# EAGLE design LED_Driver_SubCkt (EAGLE 7.6.0)
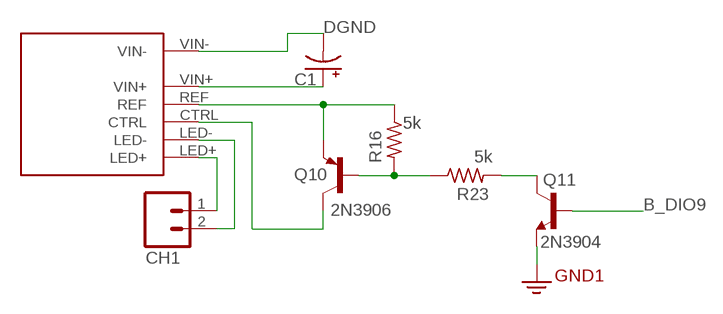
[diagram p0: schematic, sheet 1]

## Parts
BUCKPUCK1  BUCKPUCK-350-I  [BUCKPUCK_I]
C1  CPOL-USE5-10.5  [E5-10,5]
CH1  M023.5MM_LOCK  [SCREWTERMINAL-3.5MM-2_LOCK]
Q10  2N3906  MMBT3906LT1-PNP-SOT23-BEC  [SOT23-BEC]
Q11  2N3904  MMBT3904LT1-NPN-SOT23-BEC  [SOT23-BEC]
R16  5k  RESISTOR_SM0805S  [0805S]
R23  5k  RESISTOR_SM0805S  [0805S]

## Nets
B_DIO9: Q11.B
CTRL1: BUCKPUCK1.CTRL Q10.C
DGND: BUCKPUCK1.LED- BUCKPUCK1.VIN- C1.- CH1.2 Q11.E ; supply symbol labelled GND2
N$13: BUCKPUCK1.LED+ CH1.1
N$16: BUCKPUCK1.VIN+ C1.+
N$22: BUCKPUCK1.REF Q10.E R16.1
N$29: Q10.B R16.2 R23.1
N$42: Q11.C R23.2

## Library data of the parts
BUCKPUCK1 = Pavel-PowerIC:BUCKPUCK-*-?
C1 = adafruit:CPOL-US: POLARIZED CAPACITOR, American symbol
CH1 = SparkFun:M02: Header 2 Standard 2-pin 0.1" header. Use with straight break away headers (SKU : PRT-00116), right angle break away headers (PRT-00553), swiss pins (PRT-00743), machine pins (PRT-00117), and female headers (PRT-00115). Molex polarized connector foot print use with SKU : PRT-08233 with associated crimp pins and housings.
Q10 = transistor:*-PNP-: PNP Transistror
Q11 = transistor-neu-to92:*-NPN-: NPN Transistror
R16 R23 = SteveS:RESISTOR_SM

## Board
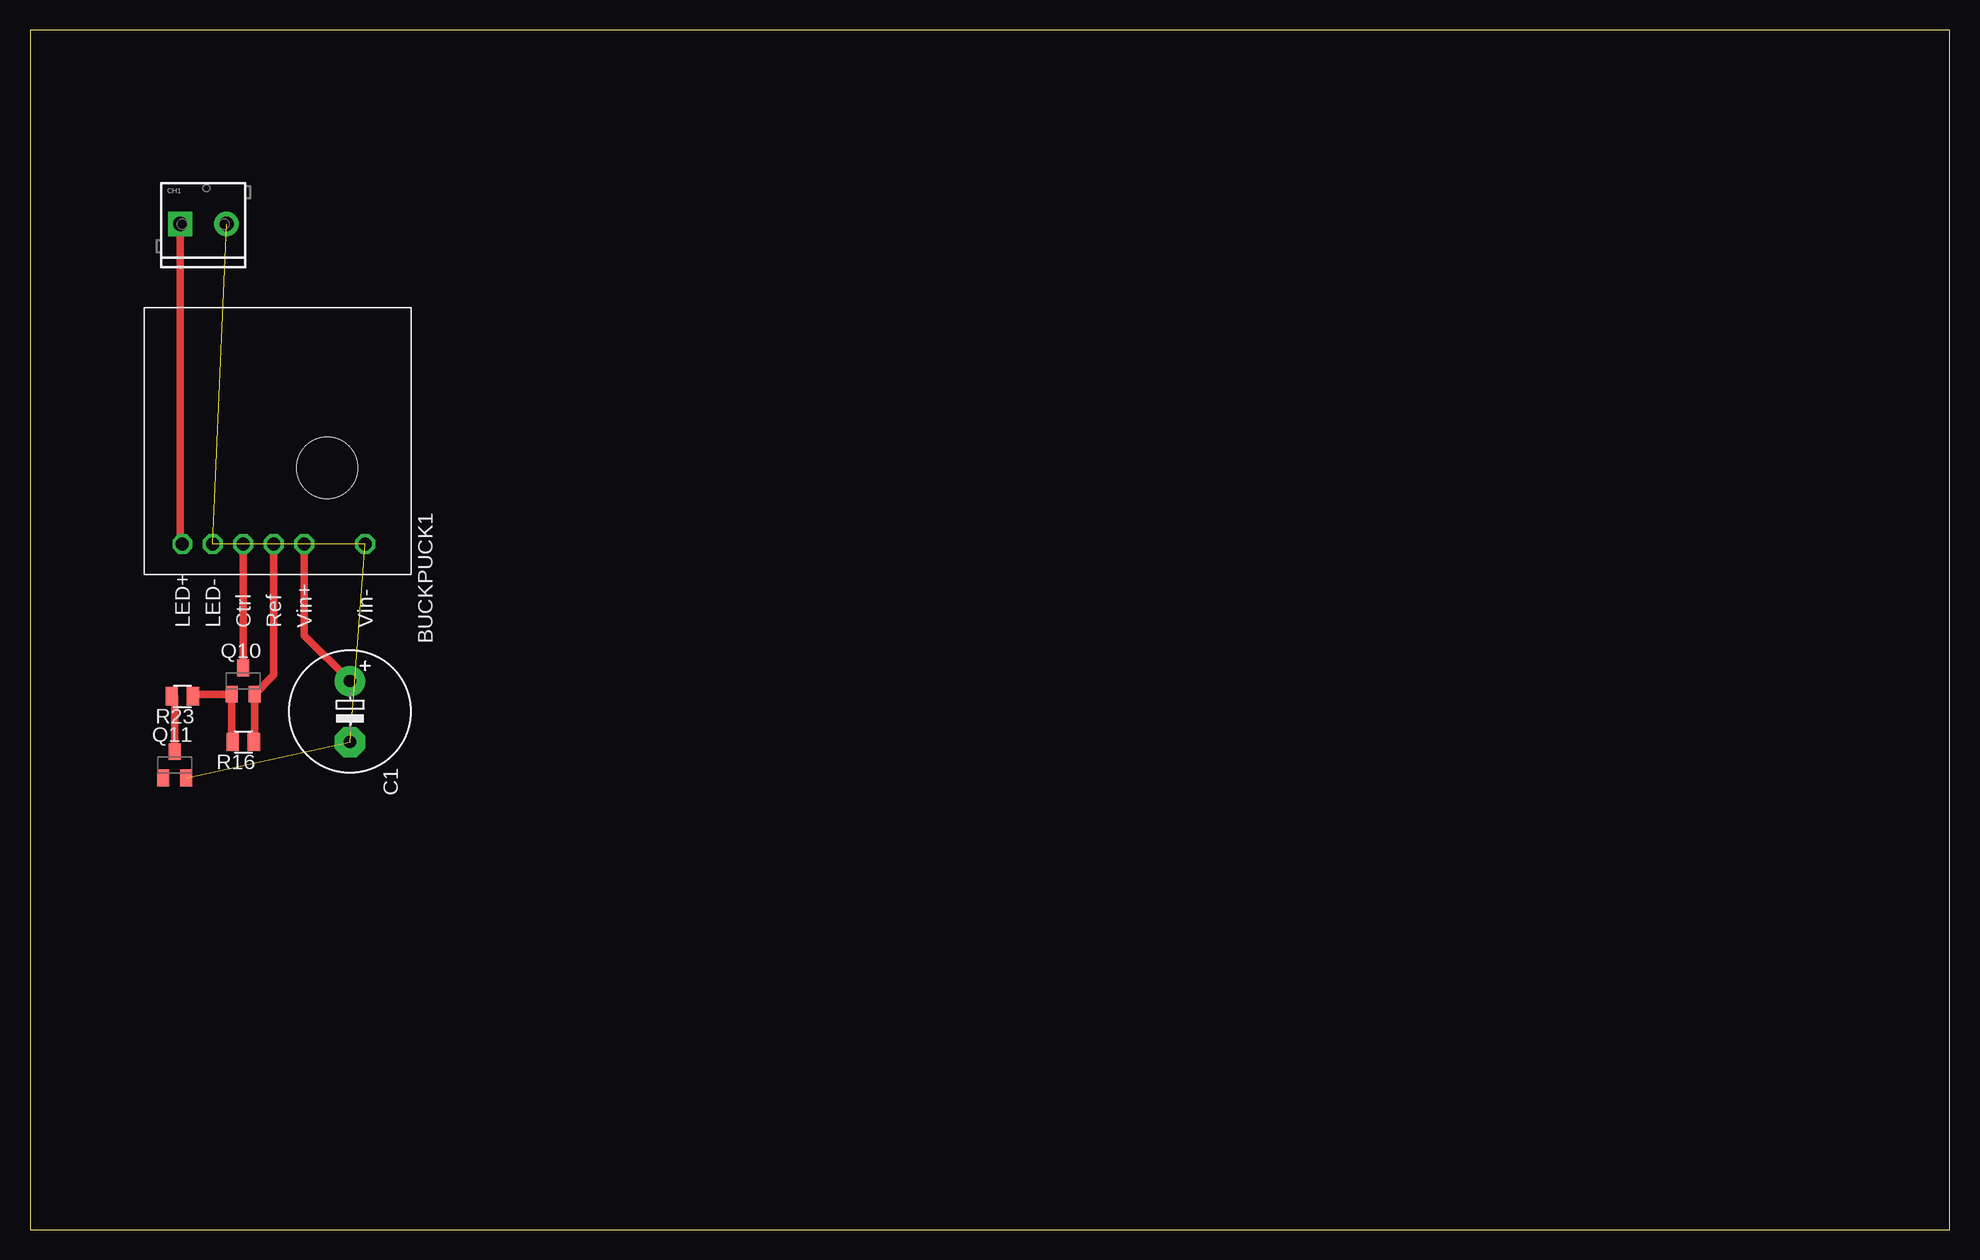
[diagram p1: board, top side]

Size 160 x 100 mm. Coordinates in mm from the lower left corner, seen from the top.
Outline: 0,0 160,0 160,100 0,100 0,0
Copper layers (1*16): Top 0.035mm / dielectric 1.5mm / Bottom 0.035mm
Design rules "default": minimum track width 10mil, minimum drill 24mil, track to track 8mil, track to pad 8mil, pad to pad 8mil, via to via 8mil, smd to smd 8mil, copper to edge 40mil, drill to drill 8mil, minimum pad ring 10mil, minimum via ring 8mil, stop-mask expansion 4mil, vias tented up to drill 0mil, thermal gap 10mil

### Footprints (pad centres in the part's own frame; a part is rotated, then mirrored left to right if it is on the bottom)
BUCKPUCK_I = drill 1.1 octagon: CTRL -8.89,2.54; LED+ -8.89,7.62; LED- -8.89,5.08; REF -8.89,0; VIN+ -8.89,-2.54; VIN- -8.89,-7.62 | hole 5.08: -2.54,-4.445
E5-10,5 = drill 1.016 pad 2.54: + -2.54,0 | drill 1.016 pad 2.54 octagon: - 2.54,0
SCREWTERMINAL-3.5MM-2_LOCK = drill 1.2 pad 2.032 square: 1 -0.178,0 | drill 1.2 pad 2.032: 2 3.678,0
SOT23-BEC = smd 1 x 1.4: B -0.95,-1.1; C 0,1.1; E 0.95,-1.1
0805S = smd 1.016 x 1.524: 1 -0.889,0; 2 0.889,0

### Placement (x,y rotation side)
BUCKPUCK1  20.32,66.04 90 top
C1  26.67,43.18 270 top
CH1  12.7,83.82 0 top
Q10  17.78,45.72 0 top
Q11  12.06,38.73 0 top
R16  17.78,40.64 180 top
R23  12.7,44.45 180 top

### Tracks (layer width: path | path; a pad name or v marks a point on that pad's centre or on a via)
CTRL1
  Top 0.61: Q10.C BUCKPUCK1.CTRL
DGND  (4 unrouted)
N$13
  Top 0.61: BUCKPUCK1.LED+ 12.52,57.15 CH1.1
N$16
  Top 0.61: BUCKPUCK1.VIN+ 22.86,49.53 C1.+
N$22
  Top 0.61: BUCKPUCK1.REF 20.32,46.21 Q10.E 18.73,40.7 R16.1
N$29
  Top 0.61: 13.42,44.62 R23.1 13.59,44.62 Q10.B 16.83,40.7 R16.2
N$42
  Top 0.61: R23.2 12.06,44.45 Q11.C